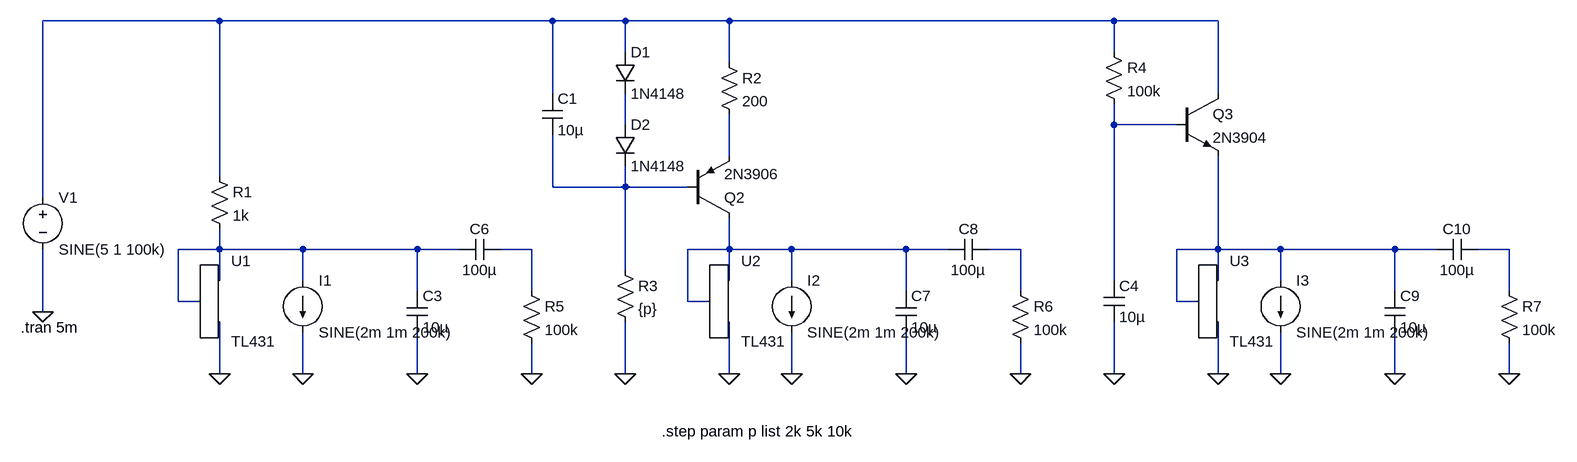
[diagram p0: schematic voltage_reference.asc]
voltage_reference.asc, the LTspice schematic file:
Version 4
SHEET 1 2240 680
WIRE 176 -80 -96 -80
WIRE 688 -80 176 -80
WIRE 800 -80 688 -80
WIRE 960 -80 800 -80
WIRE 1552 -80 960 -80
WIRE 1712 -80 1552 -80
WIRE 800 -32 800 -80
WIRE 1552 -32 1552 -80
WIRE 960 -16 960 -80
WIRE 688 32 688 -80
WIRE 1712 32 1712 -80
WIRE 800 80 800 32
WIRE 1552 80 1552 48
WIRE 1648 80 1552 80
WIRE 960 128 960 64
WIRE 176 160 176 -80
WIRE 688 176 688 96
WIRE 800 176 800 144
WIRE 800 176 688 176
WIRE 896 176 800 176
WIRE -96 192 -96 -80
WIRE 176 272 176 240
WIRE 176 272 112 272
WIRE 304 272 176 272
WIRE 480 272 304 272
WIRE 544 272 480 272
WIRE 656 272 608 272
WIRE 960 272 960 224
WIRE 960 272 896 272
WIRE 1056 272 960 272
WIRE 1232 272 1056 272
WIRE 1296 272 1232 272
WIRE 1408 272 1360 272
WIRE 1712 272 1712 128
WIRE 1712 272 1648 272
WIRE 1808 272 1712 272
WIRE 1984 272 1808 272
WIRE 2048 272 1984 272
WIRE 2160 272 2112 272
WIRE 800 304 800 176
WIRE 176 320 176 272
WIRE 304 320 304 272
WIRE 960 320 960 272
WIRE 1056 320 1056 272
WIRE 1552 320 1552 80
WIRE 1712 320 1712 272
WIRE 1808 320 1808 272
WIRE 480 336 480 272
WIRE 656 336 656 272
WIRE 1232 336 1232 272
WIRE 1408 336 1408 272
WIRE 1984 336 1984 272
WIRE 2160 336 2160 272
WIRE 112 352 112 272
WIRE 144 352 112 352
WIRE 896 352 896 272
WIRE 928 352 896 352
WIRE 1648 352 1648 272
WIRE 1680 352 1648 352
WIRE -96 368 -96 272
WIRE 176 464 176 384
WIRE 304 464 304 400
WIRE 480 464 480 400
WIRE 656 464 656 416
WIRE 800 464 800 384
WIRE 960 464 960 384
WIRE 1056 464 1056 400
WIRE 1232 464 1232 400
WIRE 1408 464 1408 416
WIRE 1552 464 1552 384
WIRE 1712 464 1712 384
WIRE 1808 464 1808 400
WIRE 1984 464 1984 400
WIRE 2160 464 2160 416
FLAG 176 464 0
FLAG -96 368 0
FLAG 960 464 0
FLAG 800 464 0
FLAG 480 464 0
FLAG 1712 464 0
FLAG 1552 464 0
FLAG 656 464 0
FLAG 1232 464 0
FLAG 1408 464 0
FLAG 1984 464 0
FLAG 2160 464 0
FLAG 304 464 0
FLAG 1056 464 0
FLAG 1808 464 0
SYMBOL ZZZ\\REF\\TL431 160 320 R0
SYMATTR InstName U1
SYMBOL res 160 144 R0
SYMATTR InstName R1
SYMATTR Value 1k
SYMBOL voltage -96 176 R0
WINDOW 123 0 0 Left 0
WINDOW 39 0 0 Left 0
SYMATTR InstName V1
SYMATTR Value SINE(5 1 100k)
SYMBOL ZZZ\\REF\\TL431 944 320 R0
SYMATTR InstName U2
SYMBOL pnp 896 224 M180
SYMATTR InstName Q2
SYMATTR Value 2N3906
SYMBOL res 944 -32 R0
SYMATTR InstName R2
SYMATTR Value 200
SYMBOL diode 784 -32 R0
SYMATTR InstName D1
SYMATTR Value 1N4148
SYMBOL diode 784 80 R0
SYMATTR InstName D2
SYMATTR Value 1N4148
SYMBOL res 784 288 R0
SYMATTR InstName R3
SYMATTR Value {p}
SYMBOL cap 672 32 R0
SYMATTR InstName C1
SYMATTR Value 10µ
SYMBOL cap 464 336 R0
SYMATTR InstName C3
SYMATTR Value 10µ
SYMBOL ZZZ\\REF\\TL431 1696 320 R0
SYMATTR InstName U3
SYMBOL npn 1648 32 R0
SYMATTR InstName Q3
SYMATTR Value 2N3904
SYMBOL res 1536 -48 R0
SYMATTR InstName R4
SYMATTR Value 100k
SYMBOL cap 1536 320 R0
SYMATTR InstName C4
SYMATTR Value 10µ
SYMBOL cap 608 256 R90
WINDOW 0 0 32 VBottom 2
WINDOW 3 32 32 VTop 2
SYMATTR InstName C6
SYMATTR Value 100µ
SYMBOL res 640 320 R0
SYMATTR InstName R5
SYMATTR Value 100k
SYMBOL cap 1216 336 R0
SYMATTR InstName C7
SYMATTR Value 10µ
SYMBOL cap 1360 256 R90
WINDOW 0 0 32 VBottom 2
WINDOW 3 32 32 VTop 2
SYMATTR InstName C8
SYMATTR Value 100µ
SYMBOL res 1392 320 R0
SYMATTR InstName R6
SYMATTR Value 100k
SYMBOL cap 1968 336 R0
SYMATTR InstName C9
SYMATTR Value 10µ
SYMBOL cap 2112 256 R90
WINDOW 0 0 32 VBottom 2
WINDOW 3 32 32 VTop 2
SYMATTR InstName C10
SYMATTR Value 100µ
SYMBOL res 2144 320 R0
SYMATTR InstName R7
SYMATTR Value 100k
SYMBOL current 304 320 R0
WINDOW 123 0 0 Left 0
WINDOW 39 0 0 Left 0
SYMATTR InstName I1
SYMATTR Value SINE(2m 1m 200k)
SYMBOL current 1056 320 R0
WINDOW 123 0 0 Left 0
WINDOW 39 0 0 Left 0
SYMATTR InstName I2
SYMATTR Value SINE(2m 1m 200k)
SYMBOL current 1808 320 R0
WINDOW 123 0 0 Left 0
WINDOW 39 0 0 Left 0
SYMATTR InstName I3
SYMATTR Value SINE(2m 1m 200k)
TEXT -130 392 Left 2 !.tran 5m
TEXT 856 552 Left 2 !.step param p list 2k 5k 10k

The netlist it stands for:
* voltage_reference.asc
XU1 N006 0 N006 TL431
R1 N001 N006 1k
V1 N001 0 SINE(5 1 100k)
XU2 N008 0 N008 TL431
Q2 N008 N005 N004 0 2N3906
R2 N001 N004 200
D1 N001 N002 1N4148
D2 N002 N005 1N4148
R3 N005 0 {p}
C1 N001 N005 10µ
C3 N006 0 10µ
XU3 N010 0 N010 TL431
Q3 N001 N003 N010 0 2N3904
R4 N001 N003 100k
C4 N003 0 10µ
C6 N007 N006 100µ
R5 N007 0 100k
C7 N008 0 10µ
C8 N009 N008 100µ
R6 N009 0 100k
C9 N010 0 10µ
C10 N011 N010 100µ
R7 N011 0 100k
I1 N006 0 SINE(2m 1m 200k)
I2 N008 0 SINE(2m 1m 200k)
I3 N010 0 SINE(2m 1m 200k)
.model D D
.lib standard.dio
.model NPN NPN
.model PNP PNP
.lib standard.bjt
.tran 5m
.step param p list 2k 5k 10k
.lib TL431.mod
.backanno
.end